# EAGLE schematic BatteryBoardV1 (EAGLE 7.7.0)
EquiSat Battery Charging

## Sheet 1 of 6: Data and I/O
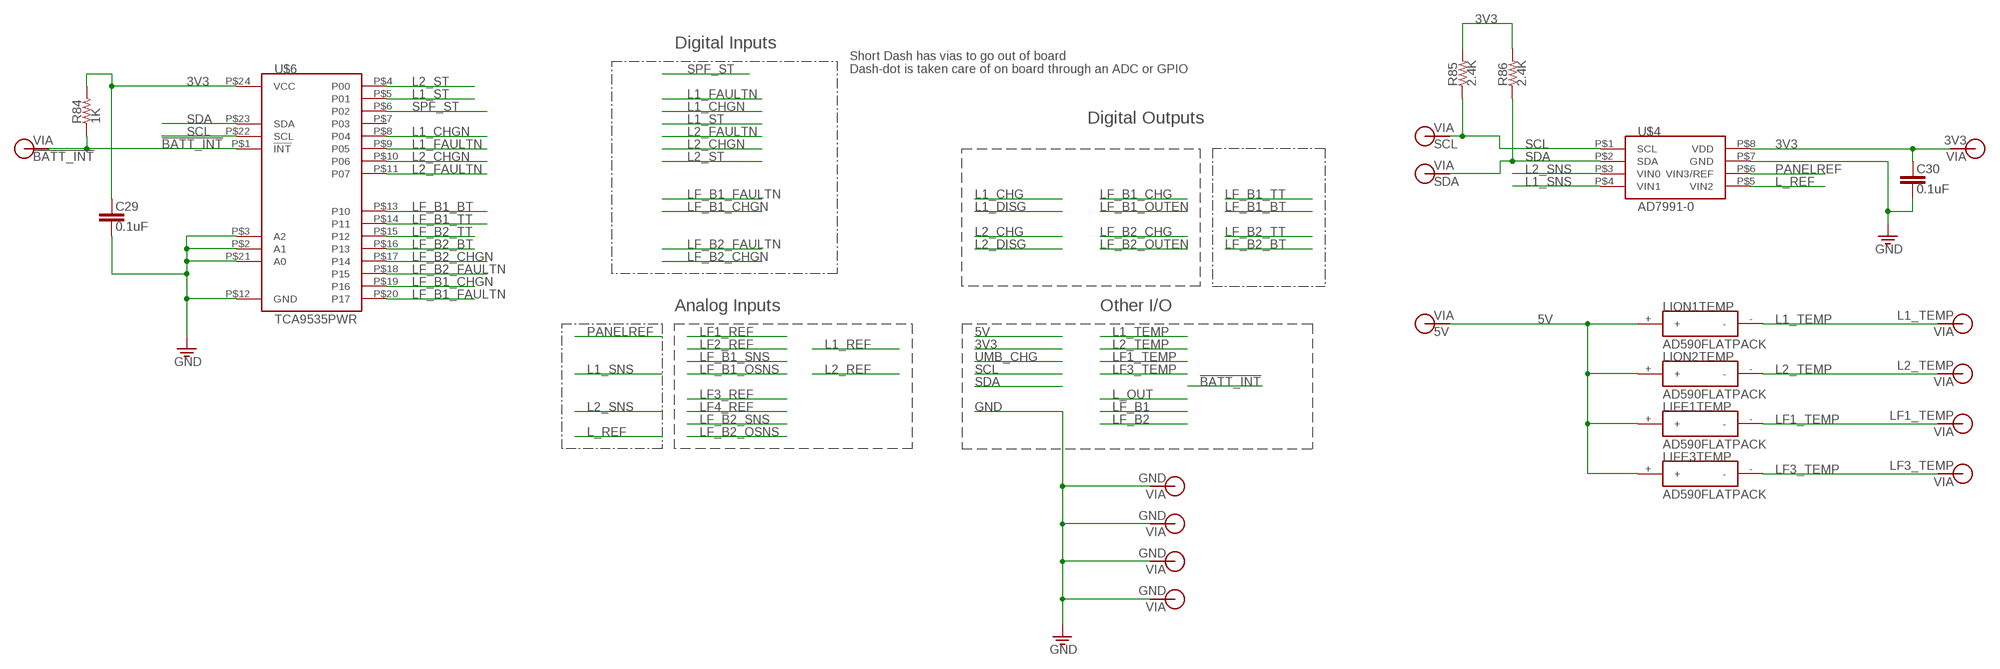
[diagram p0: schematic, sheet 1]

### Parts
C29  0.1uF  CAP0805  [0805]
C30  0.1uF  CAP0805  [0805]
LIFE1TEMP  AD590FLATPACK  [FLATPACK]
LIFE3TEMP  AD590FLATPACK  [FLATPACK]
LION1TEMP  AD590FLATPACK  [FLATPACK]
LION2TEMP  AD590FLATPACK  [FLATPACK]
R84  1K  RES0805  [0805]
R85  2.4K  RES0805  [0805]
R86  2.4K  RES0805  [0805]
U$4  AD7991-0  [SOT-23-8]
U$6  TCA9535PWR  [TSSOP-24]
V9  5V  VIA-60MIL  [VIA-60MIL]
V11  !BATT_INT!  VIA-60MIL  [VIA-60MIL]
V12  GND  VIA60MIL-SQ  [VIA-60MIL-SQ]
V13  GND  VIA-120MIL  [VIA-120MIL]
V22  GND  VIA-120MIL  [VIA-120MIL]
V23  GND  VIA-120MIL  [VIA-120MIL]
V24  L1_TEMP  VIA-60MIL  [VIA-60MIL]
V32  L2_TEMP  VIA-60MIL  [VIA-60MIL]
V37  LF1_TEMP  VIA-60MIL  [VIA-60MIL]
V50  LF3_TEMP  VIA-60MIL  [VIA-60MIL]
V51  3V3  VIA-60MIL  [VIA-60MIL]
V52  SCL  VIA-60MIL  [VIA-60MIL]
V53  SDA  VIA-60MIL  [VIA-60MIL]

### Nets
3V3: C29.1 C30.1 R84.2 R85.2 R86.2 U$4.P$8(VDD) U$6.P$24(VCC) V51.P$1 ; also sheet 2,3,5,6
5V: LIFE1TEMP.+ LIFE3TEMP.+ LION1TEMP.+ LION2TEMP.+ V9.P$1
!BATT_INT!: R84.1 U$6.P$1(!INT!) V11.P$1
GND: C29.2 C30.2 U$4.P$7(GND) U$6.P$2(A1) U$6.P$3(A2) U$6.P$12(GND) U$6.P$21(A0) V12.P$1 V13.P$1 V22.P$1 V23.P$1 ; also sheet 2,3,4,5,6
L1_CHGN: U$6.P$8(P04) ; also sheet 3
L1_FAULTN: U$6.P$9(P05) ; also sheet 3
L1_SNS: U$4.P$4(VIN1) ; also sheet 3
L1_ST: U$6.P$5(P01) ; also sheet 4
L1_TEMP: LION1TEMP.- V24.P$1
L2_CHGN: U$6.P$10(P06) ; also sheet 3
L2_FAULTN: U$6.P$11(P07) ; also sheet 3
L2_SNS: U$4.P$3(VIN0) ; also sheet 3
L2_ST: U$6.P$4(P00) ; also sheet 4
L2_TEMP: LION2TEMP.- V32.P$1
L_REF: U$4.P$5(VIN2) ; also sheet 4
LF1_TEMP: LIFE1TEMP.- V37.P$1
LF3_TEMP: LIFE3TEMP.- V50.P$1
LF_B1_BT: U$6.P$13(P10) ; also sheet 5
LF_B1_CHGN: U$6.P$19(P16) ; also sheet 5
LF_B1_FAULTN: U$6.P$20(P17) ; also sheet 5
LF_B1_TT: U$6.P$14(P11) ; also sheet 5
LF_B2_BT: U$6.P$16(P13) ; also sheet 6
LF_B2_CHGN: U$6.P$17(P14) ; also sheet 6
LF_B2_FAULTN: U$6.P$18(P15) ; also sheet 6
LF_B2_TT: U$6.P$15(P12) ; also sheet 6
PANELREF: U$4.P$6(VIN3/REF) ; also sheet 2
SCL: R85.1 U$4.P$1(SCL) U$6.P$22(SCL) V52.P$1
SDA: R86.1 U$4.P$2(SDA) U$6.P$23(SDA) V53.P$1
SPF_ST: U$6.P$6(P02) ; also sheet 2
Unconnected: U$6.P$7(P03)

### Notes on the sheet
- Digital Inputs
- Short Dash has vias to go out of board
  Dash-dot is taken care of on board through an ADC or GPIO
- Digital Outputs
- Analog Inputs | Other I/O

## Sheet 2 of 6: Solar Panel Front End
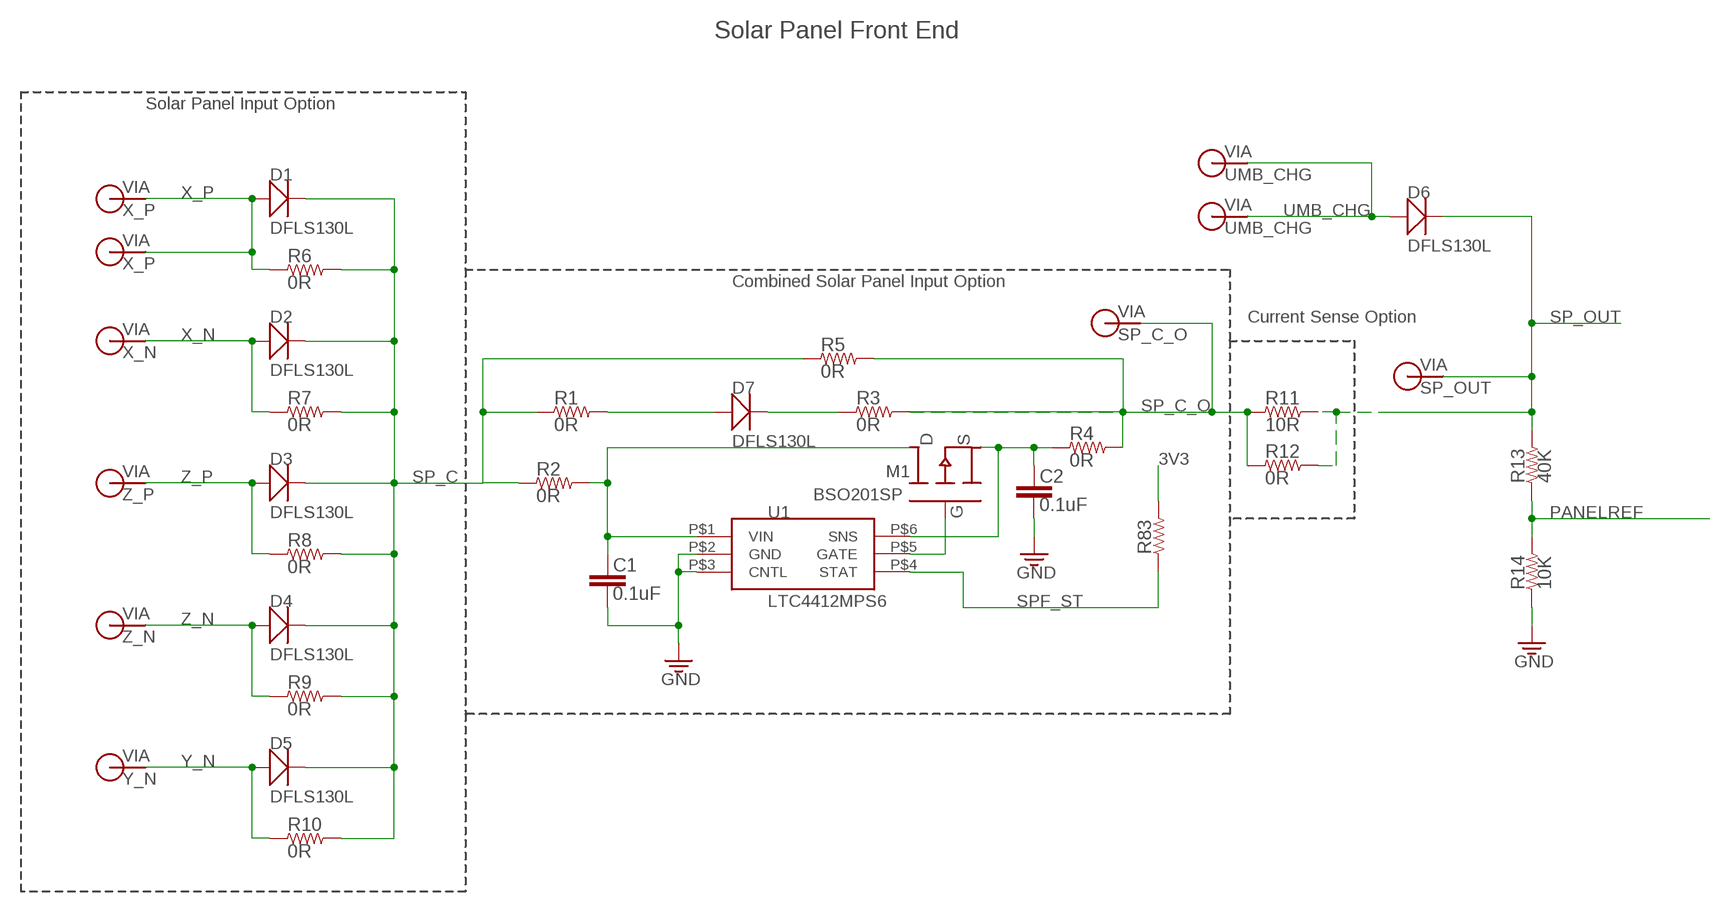
[diagram p1: schematic, sheet 2]

### Parts
C1  0.1uF  CAP0805  [0805]
C2  0.1uF  CAP0805  [0805]
D1  DFLS130L  [PWRDI-123]
D2  DFLS130L  [PWRDI-123]
D3  DFLS130L  [PWRDI-123]
D4  DFLS130L  [PWRDI-123]
D5  DFLS130L  [PWRDI-123]
D6  DFLS130L  [PWRDI-123]
D7  DFLS130L  [PWRDI-123]
M1  BSO201SP  [SO-8]
R1  0R  RES0805  [0805]
R2  0R  RES0805  [0805]
R3  0R  RES0805  [0805]
R4  0R  RES0805  [0805]
R5  0R  RES0805  [0805]
R6  0R  RES0805  [0805]
R7  0R  RES0805  [0805]
R8  0R  RES0805  [0805]
R9  0R  RES0805  [0805]
R10  0R  RES0805  [0805]
R11  10R  RES0805  [0805]
R12  0R  RES0805  [0805]
R13  40K  RES0805  [0805]
R14  10K  RES0805  [0805]
R83  RES0805  [0805]
U1  LTC4412MPS6  LTC4412  [TSOT23-6]
V1  UMB_CHG  VIA-60MIL  [VIA-60MIL]
V2  X_P  VIA-60MIL  [VIA-60MIL]
V3  X_N  VIA-60MIL  [VIA-60MIL]
V4  Z_P  VIA-60MIL  [VIA-60MIL]
V5  Z_N  VIA-60MIL  [VIA-60MIL]
V6  Y_N  VIA-60MIL  [VIA-60MIL]
V7  SP_C_O  VIA60MIL-SQ  [VIA-60MIL-SQ]
V8  SP_OUT  VIA60MIL-SQ  [VIA-60MIL-SQ]
V39  UMB_CHG  VIA60MIL-SQ  [VIA-60MIL-SQ]
V49  X_P  VIA60MIL-SQ  [VIA-60MIL-SQ]

### Nets
3V3: R83.2 ; also sheet 1,3,5,6
GND: C1.2 C2.2 R14.1 U1.P$2(GND) U1.P$3(CNTL) ; also sheet 1,3,4,5,6
N$1: M1.P$4(G) U1.P$5(GATE)
N$2: C2.1 M1.P$1(S) M1.P$2(S) M1.P$3(S) R4.1 U1.P$6(SNS)
N$3: D7.A R1.2
N$4: D7.C R3.1
N$5: C1.1 M1.P$5(D) M1.P$6(D) M1.P$7(D) M1.P$8(D) R2.2 U1.P$1(VIN)
PANELREF: R13.1 R14.2 ; also sheet 1
SP_C: D1.C D2.C D3.C D4.C D5.C R1.1 R2.1 R5.1 R6.2 R7.2 R8.2 R9.2 R10.2
SP_C_O: R3.2 R4.2 R5.2 R11.1 R12.1 V7.P$1
SP_OUT: D6.C R11.2 R12.2 R13.2 V8.P$1 ; also sheet 3,5,6
SPF_ST: R83.1 U1.P$4(STAT) ; also sheet 1
UMB_CHG: D6.A V1.P$1 V39.P$1 ; also sheet 1
X_N: D2.A R7.1 V3.P$1
X_P: D1.A R6.1 V2.P$1 V49.P$1
Y_N: D5.A R10.1 V6.P$1
Z_N: D4.A R9.1 V5.P$1
Z_P: D3.A R8.1 V4.P$1

### Notes on the sheet
- Solar Panel Front End
- Solar Panel Input Option
- Combined Solar Panel Input Option
- Current Sense Option

## Sheet 3 of 6: Li-Ion Charging
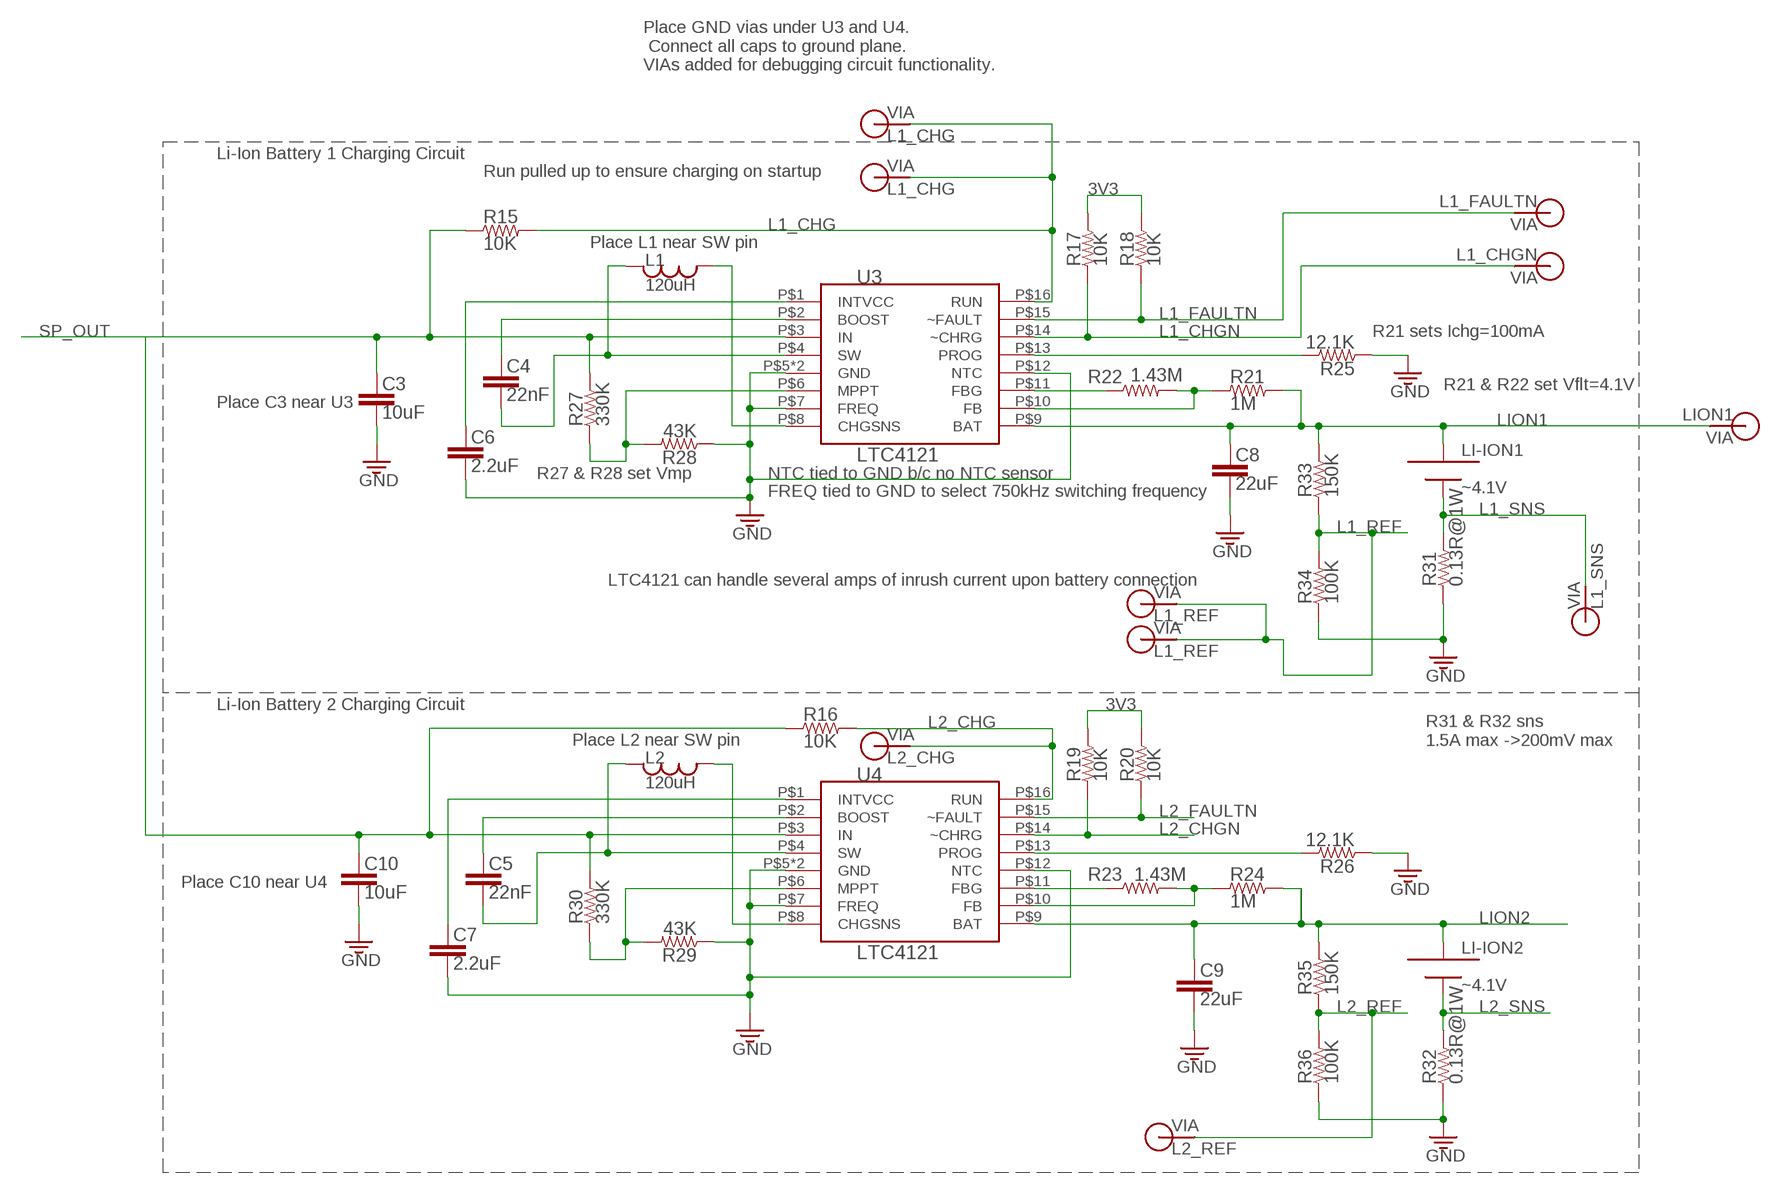
[diagram p2: schematic, sheet 3]

### Parts
C3  10uF  CAP0805  [0805]
C4  22nF  CAP0805  [0805]
C5  22nF  CAP0805  [0805]
C6  2.2uF  CAP0805  [0805]
C7  2.2uF  CAP0805  [0805]
C8  22uF  CAP0805  [0805]
C9  22uF  CAP0805  [0805]
C10  10uF  CAP0805  [0805]
L1  120uH  IND1812  [1812]
L2  120uH  IND1812  [1812]
LI-ION1  ~4.1V  LI-ION  [EQUISAT-BATTERY-VA]
LI-ION2  ~4.1V  LI-ION  [EQUISAT-BATTERY-VA]
R15  10K  RES0805  [0805]
R16  10K  RES0805  [0805]
R17  10K  RES0805  [0805]
R18  10K  RES0805  [0805]
R19  10K  RES0805  [0805]
R20  10K  RES0805  [0805]
R21  1M  RES0805  [0805]
R22  1.43M  RES0805  [0805]
R23  1.43M  RES0805  [0805]
R24  1M  RES0805  [0805]
R25  12.1K  RES0805  [0805]
R26  12.1K  RES0805  [0805]
R27  330K  RES0805  [0805]
R28  43K  RES0805  [0805]
R29  43K  RES0805  [0805]
R30  330K  RES0805  [0805]
R31  0.13R@1W  RES1210  [1210]
R32  0.13R@1W  RES1210  [1210]
R33  150K  RES0805  [0805]
R34  100K  RES0805  [0805]
R35  150K  RES0805  [0805]
R36  100K  RES0805  [0805]
U3  LTC4121  [QFN-16-PAD]
U4  LTC4121  [QFN-16-PAD]
V10  L1_CHG  VIA-60MIL  [VIA-60MIL]
V25  L1_REF  VIA-60MIL  [VIA-60MIL]
V29  L2_REF  VIA-60MIL  [VIA-60MIL]
V33  L2_CHG  VIA-60MIL  [VIA-60MIL]
V40  L1_CHG  VIA60MIL-SQ  [VIA-60MIL-SQ]
V41  L1_FAULTN  VIA60MIL-SQ  [VIA-60MIL-SQ]
V42  L1_CHGN  VIA60MIL-SQ  [VIA-60MIL-SQ]
V43  L1_SNS  VIA60MIL-SQ  [VIA-60MIL-SQ]
V44  L1_REF  VIA60MIL-SQ  [VIA-60MIL-SQ]
V45  LION1  VIA60MIL-SQ  [VIA-60MIL-SQ]

### Nets
3V3: R17.2 R18.2 R19.2 R20.2 ; also sheet 1,2,5,6
GND: C3.2 C6.2 C7.2 C8.2 C9.2 C10.2 R25.1 R26.1 R28.1 R29.1 R31.P$1 R32.P$1 R34.1 R36.1 U3.P$5(GND) U3.P$7(FREQ) U3.P$12(NTC) U3.P$17(GND) U4.P$5(GND) U4.P$7(FREQ) U4.P$12(NTC) U4.P$17(GND) ; also sheet 1,2,4,5,6
L1_CHG: R15.2 U3.P$16(RUN) V10.P$1 V40.P$1 ; also sheet 1
L1_CHGN: R17.1 U3.P$14(~CHRG) V42.P$1 ; also sheet 1
L1_FAULTN: R18.1 U3.P$15(~FAULT) V41.P$1 ; also sheet 1
L1_REF: R33.1 R34.2 V25.P$1 V44.P$1 ; also sheet 1
L1_SNS: LI-ION1.MINUS R31.P$2 V43.P$1 ; also sheet 1
L2_CHG: R16.2 U4.P$16(RUN) V33.P$1 ; also sheet 1
L2_CHGN: R19.1 U4.P$14(~CHRG) ; also sheet 1
L2_FAULTN: R20.1 U4.P$15(~FAULT) ; also sheet 1
L2_REF: R35.1 R36.2 V29.P$1 ; also sheet 1
L2_SNS: LI-ION2.MINUS R32.P$2 ; also sheet 1
LION1: C8.1 LI-ION1.PLUS R21.2 R33.2 U3.P$9(BAT) V45.P$1 ; also sheet 4
LION2: C9.1 LI-ION2.PLUS R24.2 R35.2 U4.P$9(BAT) ; also sheet 4
N$8: C4.2 L1.P$1 U3.P$4(SW)
N$9: C4.1 U3.P$2(BOOST)
N$10: C5.1 U4.P$2(BOOST)
N$11: C5.2 L2.P$1 U4.P$4(SW)
N$12: C7.1 U4.P$1(INTVCC)
N$13: C6.1 U3.P$1(INTVCC)
N$14: R23.1 U4.P$11(FBG)
N$15: R23.2 R24.1 U4.P$10(FB)
N$16: R22.1 U3.P$11(FBG)
N$17: R21.1 R22.2 U3.P$10(FB)
N$18: L1.P$2 U3.P$8(CHGSNS)
N$19: R25.2 U3.P$13(PROG)
N$20: R26.2 U4.P$13(PROG)
N$21: R29.2 R30.1 U4.P$6(MPPT)
N$22: R27.1 R28.2 U3.P$6(MPPT)
N$23: L2.P$2 U4.P$8(CHGSNS)
SP_OUT: C3.1 C10.1 R15.1 R16.1 R27.2 R30.2 U3.P$3(IN) U4.P$3(IN) ; also sheet 2,5,6

### Notes on the sheet
- Place GND vias under U3 and U4.
   Connect all caps to ground plane.
  VIAs added for debugging circuit functionality.
- Li-Ion Battery 1 Charging Circuit
- Run pulled up to ensure charging on startup
- Place L1 near SW pin
- R21 sets Ichg=100mA
- R21 & R22 set Vflt=4.1V
- Place C3 near U3
- R27 & R28 set Vmp | NTC tied to GND b/c no NTC sensor
- FREQ tied to GND to select 750kHz switching frequency
- LTC4121 can handle several amps of inrush current upon battery connection
- Li-Ion Battery 2 Charging Circuit
- Place L2 near SW pin
- R31 & R32 sns
  1.5A max ->200mV max
- Place C10 near U4

## Sheet 4 of 6: Li-Ion Diode Or'ing
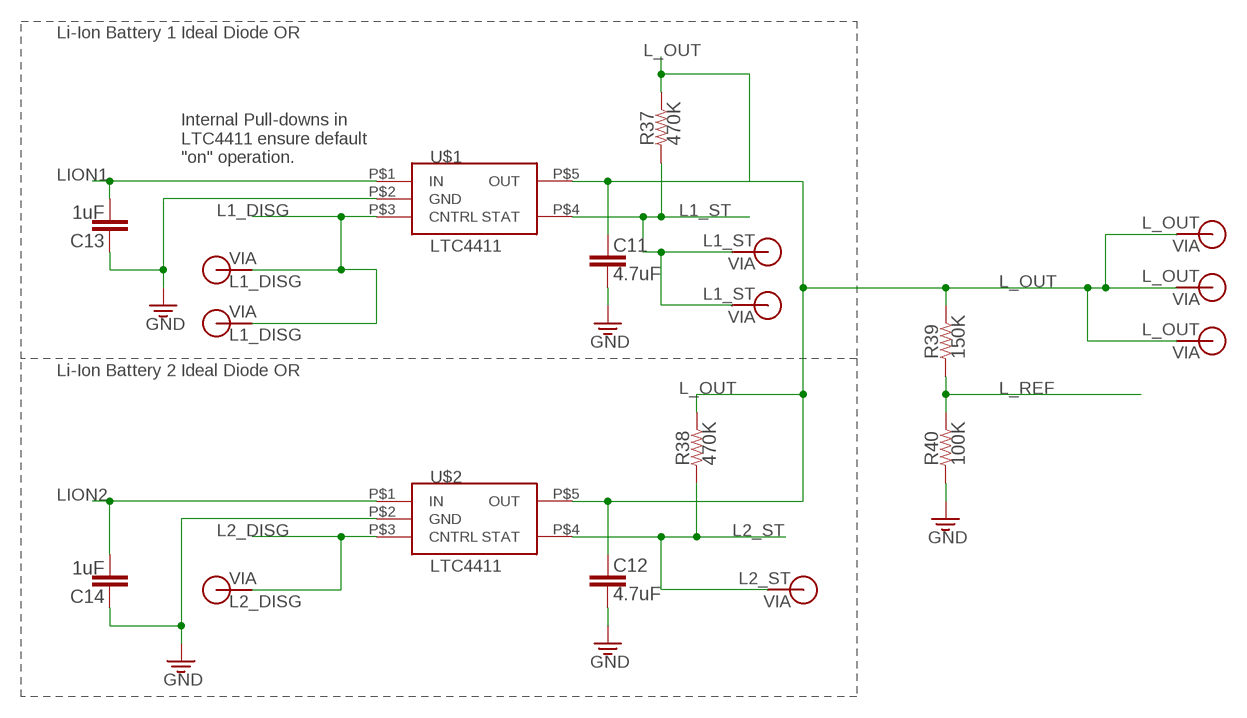
[diagram p3: schematic, sheet 4]

### Parts
C11  4.7uF  CAP0805  [0805]
C12  4.7uF  CAP0805  [0805]
C13  1uF  CAP0805  [0805]
C14  1uF  CAP0805  [0805]
R37  470K  RES0805  [0805]
R38  470K  RES0805  [0805]
R39  150K  RES0805  [0805]
R40  100K  RES0805  [0805]
U$1  LTC4411  [TSOT23-5]
U$2  LTC4411  [TSOT23-5]
V30  L_OUT  VIA-120MIL  [VIA-120MIL]
V34  L1_DISG  VIA-60MIL  [VIA-60MIL]
V35  L2_DISG  VIA-60MIL  [VIA-60MIL]
V36  L1_ST  VIA-60MIL  [VIA-60MIL]
V38  L2_ST  VIA-60MIL  [VIA-60MIL]
V46  L1_DISG  VIA60MIL-SQ  [VIA-60MIL-SQ]
V47  L1_ST  VIA60MIL-SQ  [VIA-60MIL-SQ]
V48  L_OUT  VIA60MIL-SQ  [VIA-60MIL-SQ]
V54  L_OUT  VIA-120MIL  [VIA-120MIL]

### Nets
GND: C11.2 C12.2 C13.1 C14.1 R40.1 U$1.P$2(GND) U$2.P$2(GND) ; also sheet 1,2,3,5,6
L1_DISG: U$1.P$3(CNTRL) V34.P$1 V46.P$1 ; also sheet 1
L1_ST: R37.1 U$1.P$4(STAT) V36.P$1 V47.P$1 ; also sheet 1
L2_DISG: U$2.P$3(CNTRL) V35.P$1 ; also sheet 1
L2_ST: R38.1 U$2.P$4(STAT) V38.P$1 ; also sheet 1
L_OUT: C11.1 C12.1 R37.2 R38.2 R39.2 U$1.P$5(OUT) U$2.P$5(OUT) V30.P$1 V48.P$1 V54.P$1 ; also sheet 1
L_REF: R39.1 R40.2 ; also sheet 1
LION1: C13.2 U$1.P$1(IN) ; also sheet 3
LION2: C14.2 U$2.P$1(IN) ; also sheet 3

### Notes on the sheet
- Li-Ion Battery 1 Ideal Diode OR
- Internal Pull-downs in
  LTC4411 ensure default
  "on" operation.
- Li-Ion Battery 2 Ideal Diode OR

## Sheet 5 of 6: LiFePO4 Bank 1 Charging
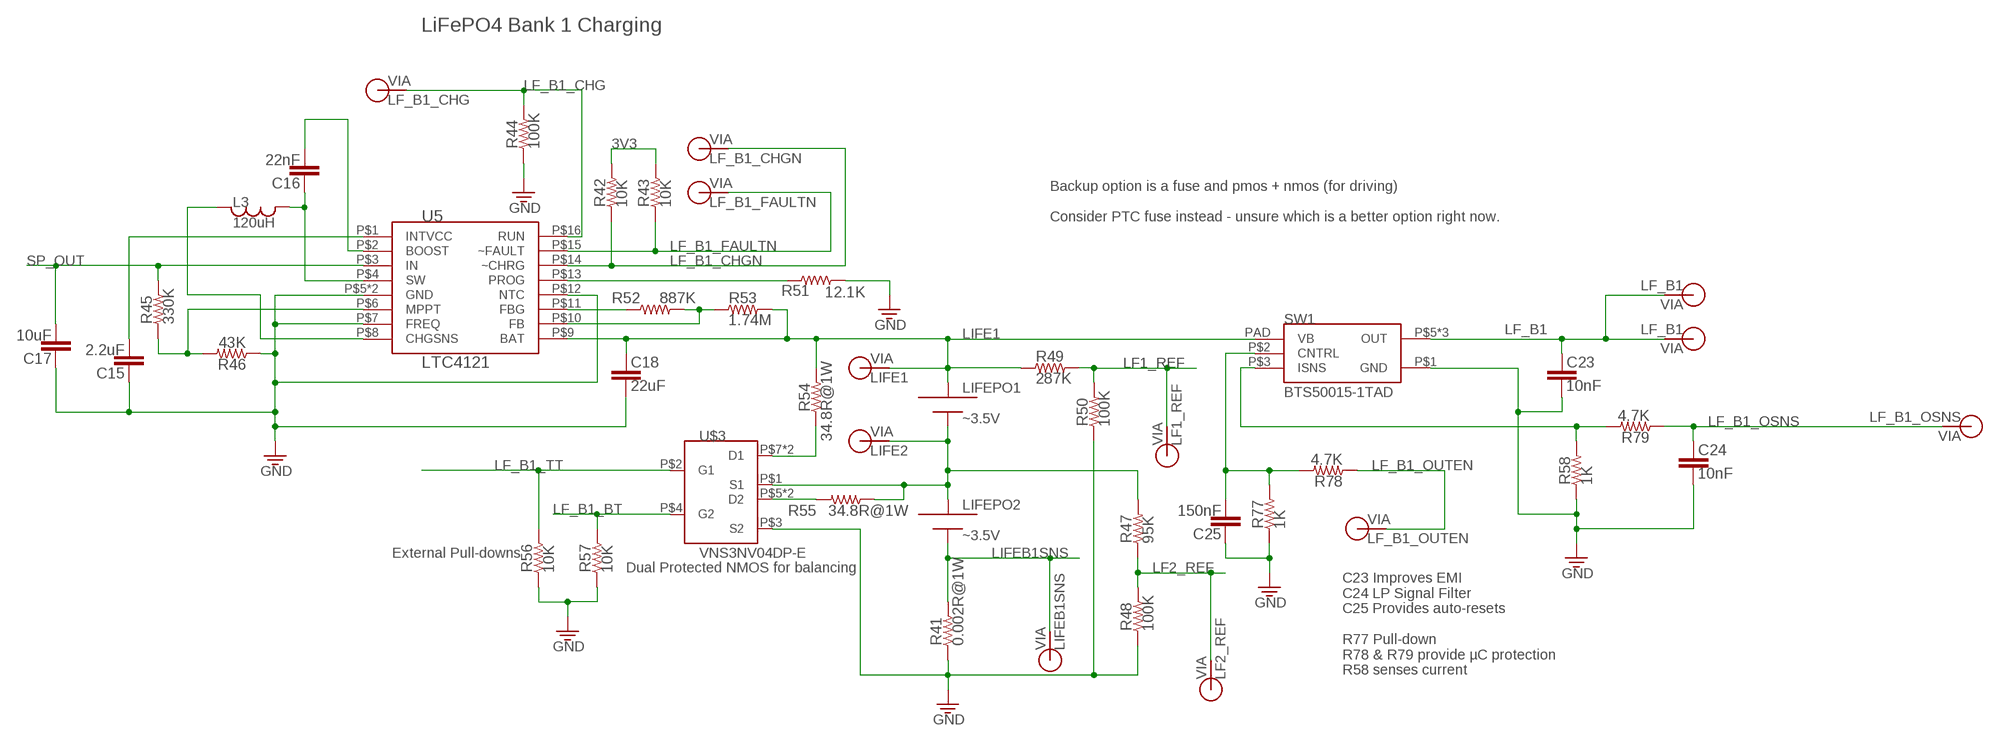
[diagram p4: schematic, sheet 5]

### Parts
C15  2.2uF  CAP0805  [0805]
C16  22nF  CAP0805  [0805]
C17  10uF  CAP0805  [0805]
C18  22uF  CAP0805  [0805]
C23  10nF  CAP0805  [0805]
C24  10nF  CAP0805  [0805]
C25  150nF  CAP0805  [0805]
L3  120uH  IND1812  [1812]
LIFEPO1  ~3.5V  LIFEPO4VA  [EQUISAT-BATTERY-VA]
LIFEPO2  ~3.5V  LIFEPO4VB  [EQUISAT-BATTERY-VB]
R41  0.002R@1W  RES1210  [1210]
R42  10K  RES0805  [0805]
R43  10K  RES0805  [0805]
R44  100K  RES0805  [0805]
R45  330K  RES0805  [0805]
R46  43K  RES0805  [0805]
R47  95K  RES0805  [0805]
R48  100K  RES0805  [0805]
R49  287K  RES0805  [0805]
R50  100K  RES0805  [0805]
R51  12.1K  RES0805  [0805]
R52  887K  RES0805  [0805]
R53  1.74M  RES0805  [0805]
R54  34.8R@1W  RES1210  [1210]
R55  34.8R@1W  RES1210  [1210]
R56  10K  RES0805  [0805]
R57  10K  RES0805  [0805]
R58  1K  RES0805  [0805]
R77  1K  RES0805  [0805]
R78  4.7K  RES0805  [0805]
R79  4.7K  RES0805  [0805]
SW1  BTS50015-1TAD  [TO-263-7-8]
U5  LTC4121  [QFN-16-PAD]
U$3  VNS3NV04DP-E  [SO-8]
V14  LIFEB1SNS  VIA-60MIL  [VIA-60MIL]
V15  LF_B1_CHG  VIA-60MIL  [VIA-60MIL]
V16  LIFE2  VIA60MIL-SQ  [VIA-60MIL-SQ]
V17  LIFE1  VIA60MIL-SQ  [VIA-60MIL-SQ]
V18  LF_B1_CHGN  VIA-60MIL  [VIA-60MIL]
V19  LF_B1_FAULTN  VIA-60MIL  [VIA-60MIL]
V20  LF_B1_OUTEN  VIA-60MIL  [VIA-60MIL]
V21  LF_B1  VIA-120MIL  [VIA-120MIL]
V26  LF_B1  VIA-120MIL  [VIA-120MIL]
V31  LF_B1_OSNS  VIA-60MIL  [VIA-60MIL]
V58  LF1_REF  VIA-60MIL  [VIA-60MIL]
V59  LF2_REF  VIA-60MIL  [VIA-60MIL]

### Nets
3V3: R42.2 R43.2 ; also sheet 1,2,3,6
GND: C15.1 C17.1 C18.2 C23.2 C24.2 C25.1 R41.P$1 R44.1 R46.1 R48.1 R50.1 R51.2 R56.1 R57.1 R58.1 R77.1 SW1.P$1(GND) U5.P$5(GND) U5.P$7(FREQ) U5.P$12(NTC) U5.P$17(GND) U$3.P$3(S2) ; also sheet 1,2,3,4,6
LF1_REF: R49.2 R50.2 V58.P$1 ; also sheet 1
LF2_REF: R47.1 R48.2 V59.P$1 ; also sheet 1
LF_B1: C23.1 SW1.P$5(OUT) SW1.P$6(OUT) SW1.P$7(OUT) V21.P$1 V26.P$1 ; also sheet 1
LF_B1_BT: R57.2 U$3.P$4(G2) ; also sheet 1
LF_B1_CHG: R44.2 U5.P$16(RUN) V15.P$1 ; also sheet 1
LF_B1_CHGN: R42.1 U5.P$14(~CHRG) V18.P$1 ; also sheet 1
LF_B1_FAULTN: R43.1 U5.P$15(~FAULT) V19.P$1 ; also sheet 1
LF_B1_OSNS: C24.1 R79.1 V31.P$1 ; also sheet 1
LF_B1_OUTEN: R78.1 V20.P$1 ; also sheet 1
LF_B1_TT: R56.2 U$3.P$2(G1) ; also sheet 1
LIFE1: C18.1 LIFEPO1.PLUS R49.1 R53.2 R54.P$2 SW1.PAD(VB) U5.P$9(BAT) V17.P$1
LIFE2: LIFEPO1.MINUS LIFEPO2.PLUS R47.2 R55.P$1 U$3.P$1(S1) V16.P$1
LIFEB1SNS: LIFEPO2.MINUS R41.P$2 V14.P$1
N$7: R51.1 U5.P$13(PROG)
N$24: R54.P$1 U$3.P$7(D1) U$3.P$8(D1)
N$25: R55.P$2 U$3.P$5(D2) U$3.P$6(D2)
N$26: R52.1 U5.P$11(FBG)
N$27: R45.1 R46.2 U5.P$6(MPPT)
N$28: R52.2 R53.1 U5.P$10(FB)
N$29: C15.2 U5.P$1(INTVCC)
N$30: C16.1 L3.P$2 U5.P$4(SW)
N$31: C16.2 U5.P$2(BOOST)
N$32: L3.P$1 U5.P$8(CHGSNS)
N$68: C25.2 R77.2 R78.2 SW1.P$2(CNTRL)
N$686: R58.2 R79.2 SW1.P$3(ISNS)
SP_OUT: C17.2 R45.2 U5.P$3(IN) ; also sheet 2,3,6

### Notes on the sheet
- LiFePO4 Bank 1 Charging
- Backup option is a fuse and pmos + nmos (for driving)
  
  Consider PTC fuse instead - unsure which is a better option right now.
- External Pull-downs
- Dual Protected NMOS for balancing
- C23 Improves EMI
  C24 LP Signal Filter
  C25 Provides auto-resets
  
  R77 Pull-down
  R78 & R79 provide µC protection
  R58 senses current

## Sheet 6 of 6: LiFePO4 Bank 2 Charging
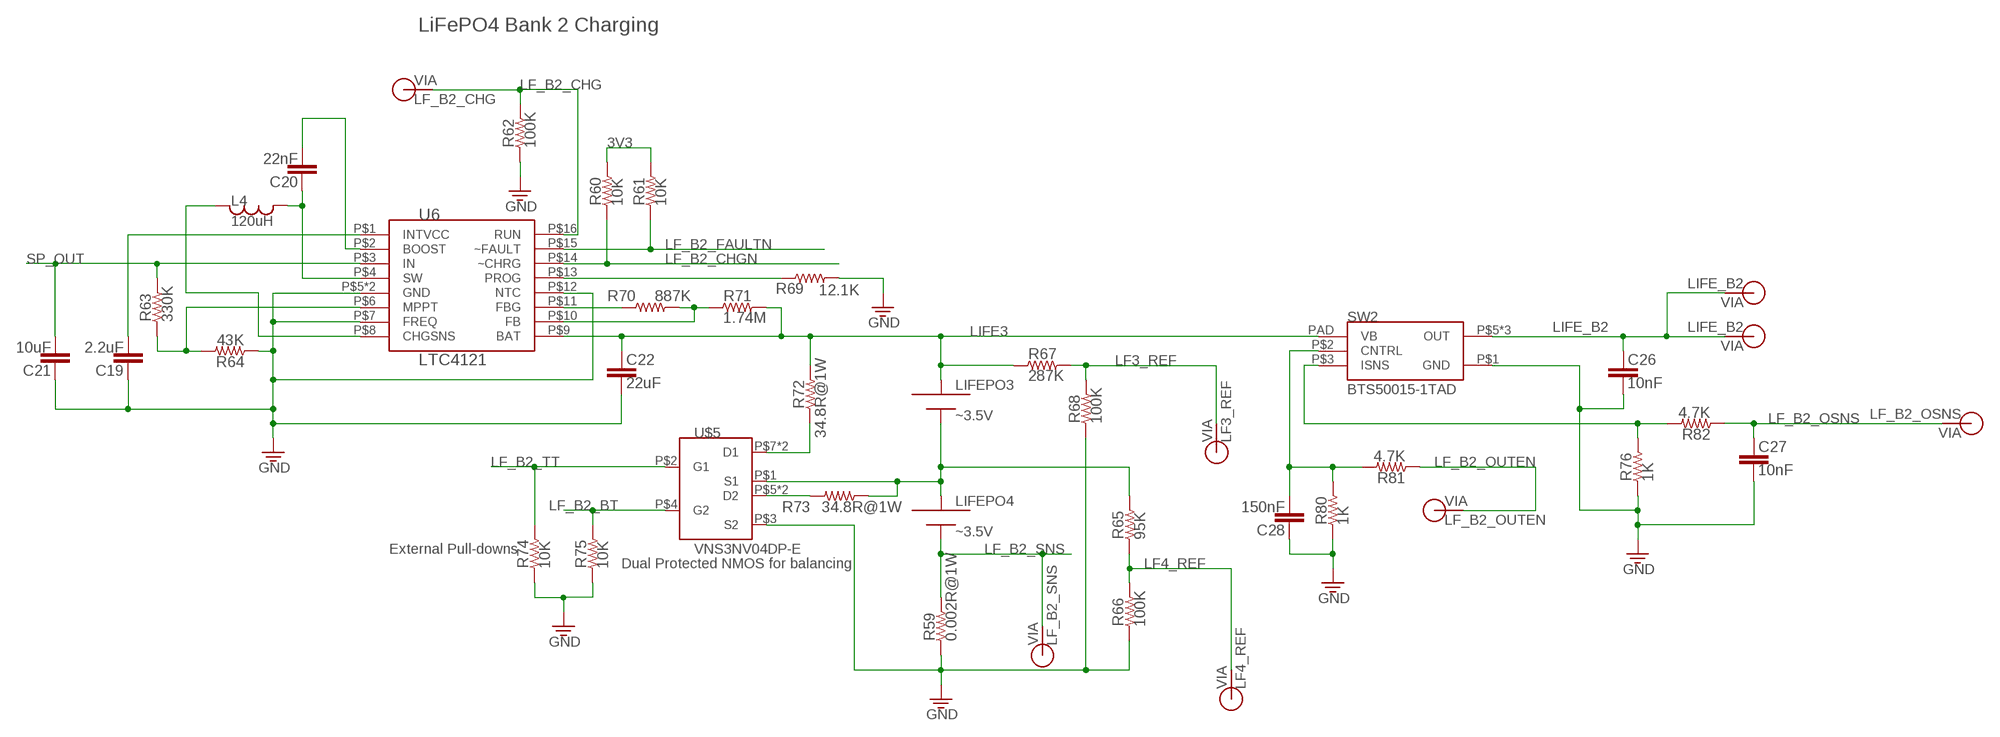
[diagram p5: schematic, sheet 6]

### Parts
C19  2.2uF  CAP0805  [0805]
C20  22nF  CAP0805  [0805]
C21  10uF  CAP0805  [0805]
C22  22uF  CAP0805  [0805]
C26  10nF  CAP0805  [0805]
C27  10nF  CAP0805  [0805]
C28  150nF  CAP0805  [0805]
L4  120uH  IND1812  [1812]
LIFEPO3  ~3.5V  LIFEPO4VA  [EQUISAT-BATTERY-VA]
LIFEPO4  ~3.5V  LIFEPO4VB  [EQUISAT-BATTERY-VB]
R59  0.002R@1W  RES1210  [1210]
R60  10K  RES0805  [0805]
R61  10K  RES0805  [0805]
R62  100K  RES0805  [0805]
R63  330K  RES0805  [0805]
R64  43K  RES0805  [0805]
R65  95K  RES0805  [0805]
R66  100K  RES0805  [0805]
R67  287K  RES0805  [0805]
R68  100K  RES0805  [0805]
R69  12.1K  RES0805  [0805]
R70  887K  RES0805  [0805]
R71  1.74M  RES0805  [0805]
R72  34.8R@1W  RES1210  [1210]
R73  34.8R@1W  RES1210  [1210]
R74  10K  RES0805  [0805]
R75  10K  RES0805  [0805]
R76  1K  RES0805  [0805]
R80  1K  RES0805  [0805]
R81  4.7K  RES0805  [0805]
R82  4.7K  RES0805  [0805]
SW2  BTS50015-1TAD  [TO-263-7-8]
U6  LTC4121  [QFN-16-PAD]
U$5  VNS3NV04DP-E  [SO-8]
V27  LIFE_B2  VIA-120MIL  [VIA-120MIL]
V28  LIFE_B2  VIA-120MIL  [VIA-120MIL]
V56  LF_B2_OUTEN  VIA-60MIL  [VIA-60MIL]
V57  LF_B2_CHG  VIA-60MIL  [VIA-60MIL]
V60  LF_B2_SNS  VIA-60MIL  [VIA-60MIL]
V61  LF4_REF  VIA-60MIL  [VIA-60MIL]
V62  LF3_REF  VIA-60MIL  [VIA-60MIL]
V63  LF_B2_OSNS  VIA-60MIL  [VIA-60MIL]

### Nets
3V3: R60.2 R61.2 ; also sheet 1,2,3,5
GND: C19.1 C21.1 C22.2 C26.2 C27.2 C28.1 R59.P$1 R62.1 R64.1 R66.1 R68.1 R69.2 R74.1 R75.1 R76.1 R80.1 SW2.P$1(GND) U6.P$5(GND) U6.P$7(FREQ) U6.P$12(NTC) U6.P$17(GND) U$5.P$3(S2) ; also sheet 1,2,3,4,5
LF3_REF: R67.2 R68.2 V62.P$1 ; also sheet 1
LF4_REF: R65.1 R66.2 V61.P$1 ; also sheet 1
LF_B2_BT: R75.2 U$5.P$4(G2) ; also sheet 1
LF_B2_CHG: R62.2 U6.P$16(RUN) V57.P$1 ; also sheet 1
LF_B2_CHGN: R60.1 U6.P$14(~CHRG) ; also sheet 1
LF_B2_FAULTN: R61.1 U6.P$15(~FAULT) ; also sheet 1
LF_B2_OSNS: C27.1 R82.1 V63.P$1 ; also sheet 1
LF_B2_OUTEN: R81.1 V56.P$1 ; also sheet 1
LF_B2_SNS: LIFEPO4.MINUS R59.P$2 V60.P$1 ; also sheet 1
LF_B2_TT: R74.2 U$5.P$2(G1) ; also sheet 1
LIFE3: C22.1 LIFEPO3.PLUS R67.1 R71.2 R72.P$2 SW2.PAD(VB) U6.P$9(BAT)
LIFE4: LIFEPO3.MINUS LIFEPO4.PLUS R65.2 R73.P$1 U$5.P$1(S1)
LIFE_B2: C26.1 SW2.P$5(OUT) SW2.P$6(OUT) SW2.P$7(OUT) V27.P$1 V28.P$1
N$33: R63.1 R64.2 U6.P$6(MPPT)
N$35: R69.1 U6.P$13(PROG)
N$36: R70.1 U6.P$11(FBG)
N$37: R70.2 R71.1 U6.P$10(FB)
N$38: C19.2 U6.P$1(INTVCC)
N$39: C20.1 L4.P$2 U6.P$4(SW)
N$40: C20.2 U6.P$2(BOOST)
N$41: L4.P$1 U6.P$8(CHGSNS)
N$42: R72.P$1 U$5.P$7(D1) U$5.P$8(D1)
N$43: R73.P$2 U$5.P$5(D2) U$5.P$6(D2)
N$451: R76.2 R82.2 SW2.P$3(ISNS)
N$1356: C28.2 R80.2 R81.2 SW2.P$2(CNTRL)
SP_OUT: C21.2 R63.2 U6.P$3(IN) ; also sheet 2,3,5

### Notes on the sheet
- LiFePO4 Bank 2 Charging
- External Pull-downs
- Dual Protected NMOS for balancing

## Library data of the parts
C1-C30 = BrownSpaceEngineering:CAP: Capacitor
D1-D7 = BrownSpaceEngineering:DFLS130L
L1-L4 = BrownSpaceEngineering:IND
LI-ION1 LI-ION2 = BrownSpaceEngineering:LI-ION
LIFE1TEMP LIFE3TEMP LION1TEMP LION2TEMP = BrownSpaceEngineering:AD590
LIFEPO1-LIFEPO4 = BrownSpaceEngineering:LIFEPO4
M1 = BrownSpaceEngineering:BSO201SP
R1-R86 = BrownSpaceEngineering:RES
SW1 SW2 = BrownSpaceEngineering:BTS50015-1TAD
U1 = BrownSpaceEngineering:LTC4412
U3-U6 = BrownSpaceEngineering:LTC4121
U$1 U$2 = BrownSpaceEngineering:LTC4411
U$3 U$5 = BrownSpaceEngineering:VNS3NV04DP-E
U$4 = BrownSpaceEngineering:AD7991
U$6 = BrownSpaceEngineering:TCA9535
V1-V54 V56-V63 = BrownSpaceEngineering:VIA